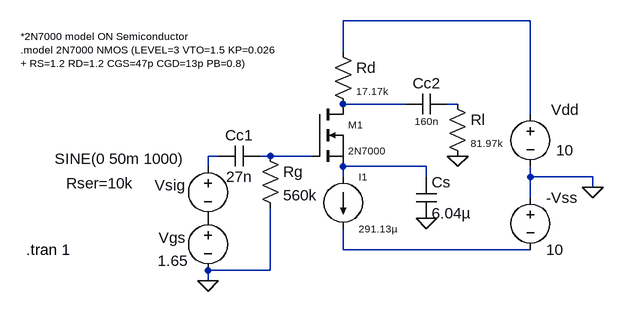
[diagram p0: schematic NNM24EE053_SiddharthKamath.asc]
NNM24EE053_SiddharthKamath.asc, the LTspice schematic file:
Version 4.1
SHEET 1 880 680
WIRE 416 -16 128 -16
WIRE 128 32 128 -16
WIRE 224 112 128 112
WIRE 304 112 288 112
WIRE 128 128 128 112
WIRE 416 128 416 -16
WIRE -64 192 -80 192
WIRE 16 192 0 192
WIRE 80 192 16 192
WIRE -80 208 -80 192
WIRE 256 208 128 208
WIRE 128 224 128 208
WIRE 256 224 256 208
WIRE 416 224 416 208
WIRE 512 224 416 224
WIRE 512 240 512 224
WIRE 416 256 416 224
WIRE 128 336 128 304
WIRE 416 336 128 336
WIRE 16 368 16 272
WIRE 16 368 -80 368
WIRE -80 384 -80 368
FLAG -80 384 0
FLAG 512 240 0
FLAG 256 288 0
FLAG 304 192 0
SYMBOL voltage 416 112 R0
WINDOW 123 0 0 Left 0
WINDOW 39 0 0 Left 0
WINDOW 0 32 9 Left 2
WINDOW 3 40 71 Left 2
SYMATTR InstName Vdd
SYMATTR Value 10
SYMBOL voltage -80 272 R0
WINDOW 123 0 0 Left 0
WINDOW 39 0 0 Left 0
WINDOW 0 -76 46 Left 2
WINDOW 3 -77 81 Left 2
SYMATTR InstName Vgs
SYMATTR Value 1.65
SYMBOL nmos 80 112 R0
WINDOW 0 56 32 Left 1
WINDOW 3 56 72 Left 1
SYMATTR InstName M1
SYMATTR Value 2N7000
SYMBOL res 112 16 R0
WINDOW 3 36 76 Left 1
SYMATTR Value 17.17k
SYMATTR InstName Rd
SYMBOL res 0 176 R0
SYMATTR InstName Rg
SYMATTR Value 560k
SYMBOL current 128 224 R0
WINDOW 0 24 0 Left 1
WINDOW 3 24 80 Left 1
WINDOW 123 0 0 Left 0
WINDOW 39 0 0 Left 0
SYMATTR InstName I1
SYMATTR Value 291.13µ
SYMBOL voltage 416 240 R0
WINDOW 123 0 0 Left 0
WINDOW 39 0 0 Left 0
SYMATTR InstName -Vss
SYMATTR Value 10
SYMBOL voltage -80 192 R0
WINDOW 0 -82 45 Left 2
WINDOW 3 -236 4 Left 2
WINDOW 123 0 0 Left 0
WINDOW 39 -218 42 Left 2
SYMATTR InstName Vsig
SYMATTR Value SINE(0 50m 1000)
SYMATTR SpiceLine Rser=10k
SYMBOL cap 240 224 R0
SYMATTR InstName Cs
SYMATTR Value 6.04µ
SYMBOL cap 0 176 R90
WINDOW 0 0 32 VBottom 2
WINDOW 3 32 32 VTop 2
SYMATTR InstName Cc1
SYMATTR Value 27n
SYMBOL cap 288 96 R90
WINDOW 0 0 32 VBottom 2
WINDOW 3 32 32 VTop 1
SYMATTR InstName Cc2
SYMATTR Value 160n
SYMBOL res 288 96 R0
WINDOW 3 36 76 Left 1
SYMATTR Value 81.97k
SYMATTR InstName Rl
TEXT -360 336 Left 2 !.tran 1
TEXT -368 8 Left 1 !*2N7000 model ON Semiconductor\n.model 2N7000 NMOS (LEVEL=3 VTO=1.5 KP=0.026\n+ RS=1.2 RD=1.2 CGS=47p CGD=13p PB=0.8)

The netlist it stands for:
* NNM24EE053_SiddharthKamath.asc
Vdd N001 0 10
Vgs P001 0 1.65
M1 N002 N005 N006 N006 2N7000
Rd N001 N002 17.17k
Rg N005 0 560k
I1 N006 N007 291.13µ
V§-Vss 0 N007 10
Vsig N004 P001 SINE(0 50m 1000) Rser=10k
Cs N006 0 6.04µ
Cc1 N005 N004 27n
Cc2 N003 N002 160n
Rl N003 0 81.97k
.model NMOS NMOS
.model PMOS PMOS
.lib standard.mos
.tran 1
*2N7000 model ON Semiconductor
.model 2N7000 NMOS (LEVEL=3 VTO=1.5 KP=0.026
+ RS=1.2 RD=1.2 CGS=47p CGD=13p PB=0.8)
.backanno
.end